# Altium schematic sheet OPT3001.SchDoc
size A4; SheetNumber: 5; SheetTotal: 6
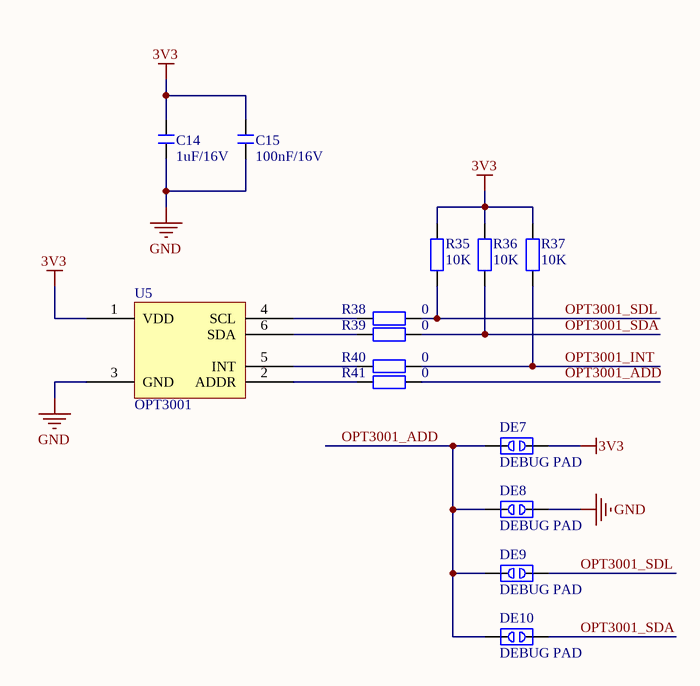
[diagram p0: OPT3001.SchDoc]

## Parts
C14  1uF/16V  [C 0402_L]
C15  100nF/16V  [C 0402_L]
DE7  DEBUG PAD  [DEBUG_A]
DE8  DEBUG PAD  [DEBUG_A]
DE9  DEBUG PAD  [DEBUG_A]
DE10  DEBUG PAD  [DEBUG_A]
R35  10K  [R 0402_L]
R36  10K  [R 0402_L]
R37  10K  [R 0402_L]
R38  0  [R 0402_L]
R39  0  [R 0402_L]
R40  0  [R 0402_L]
R41  0  [R 0402_L]
U5  OPT3001  [OPT3001]

## Nets
3V3: C14.2 C15.1 DE7.2 R35.1 R36.1 R37.1 U5.1(VDD)
GND: C14.1 C15.2 DE8.2 U5.3(GND)
OPT3001_ADD: DE7.1 DE8.1 DE9.1 DE10.1 R41.1
OPT3001_INT: R37.2 R40.1
OPT3001_SDA: DE10.2 R36.2 R39.1
OPT3001_SDL: DE9.2 R35.2 R38.1
NetR38_2: R38.2 U5.4(SCL)
NetR39_2: R39.2 U5.6(SDA)
NetR40_2: R40.2 U5.5(INT)
NetR41_2: R41.2 U5.2(ADDR)

## Library data of the parts
C14 = C: 贴片电容; 主类型: 电容; 值精度: ±10%; 元件封装: 0402; 具体类型: 陶瓷电容; 封装类型: 贴片; 温度漂移: X5R; 生产商: SAMSUNG(三星); 生产商零件编码: CL05A105KO5NNNC; 值/型号: 1uF/16V; 立创编号: C29266
C15 = C: 无极性贴片电容; 主类型: 电容; 封装类型: 贴片; 生产商: YAGEO(国巨); 生产商零件编码: CC0402KRX7R7BB104; 值/型号: 100nF/16V; 元件封装: *; 具体类型: *; 温度漂移: *; 温度范围: *; 立创编号: C60474; 类型备注: *; 手册网址: *; 官网地址: *
DE7-DE10 = DEBUG: 调试断点焊盘; 版权归属: 源创客; BOM名称: 调试断点焊盘; 学习资源: www.ooocke.com
R35-R37 = R: 贴片电阻 0402 1%; 主类型: 电阻; 元件封装: 0402; 封装类型: 贴片; 温度漂移: ±100ppm/℃; 生产商: 国巨; 生产商零件编码: RC0402FR-0710KL; 值/型号: 10K; 值精度: ±1%; 具体类型: 贴片电阻; 立创编号: C60490
R38-R41 = R: 贴片电阻; 主类型: 电阻; 元件封装: 0402; 生产商: YAGEO(国巨); 生产商零件编码: RC0402JR-070RL; 值/型号: 0; 立创编号: C60485